# Altium project LimePSB-RPCM_1v3.PrjPcb (part 14 of 14)
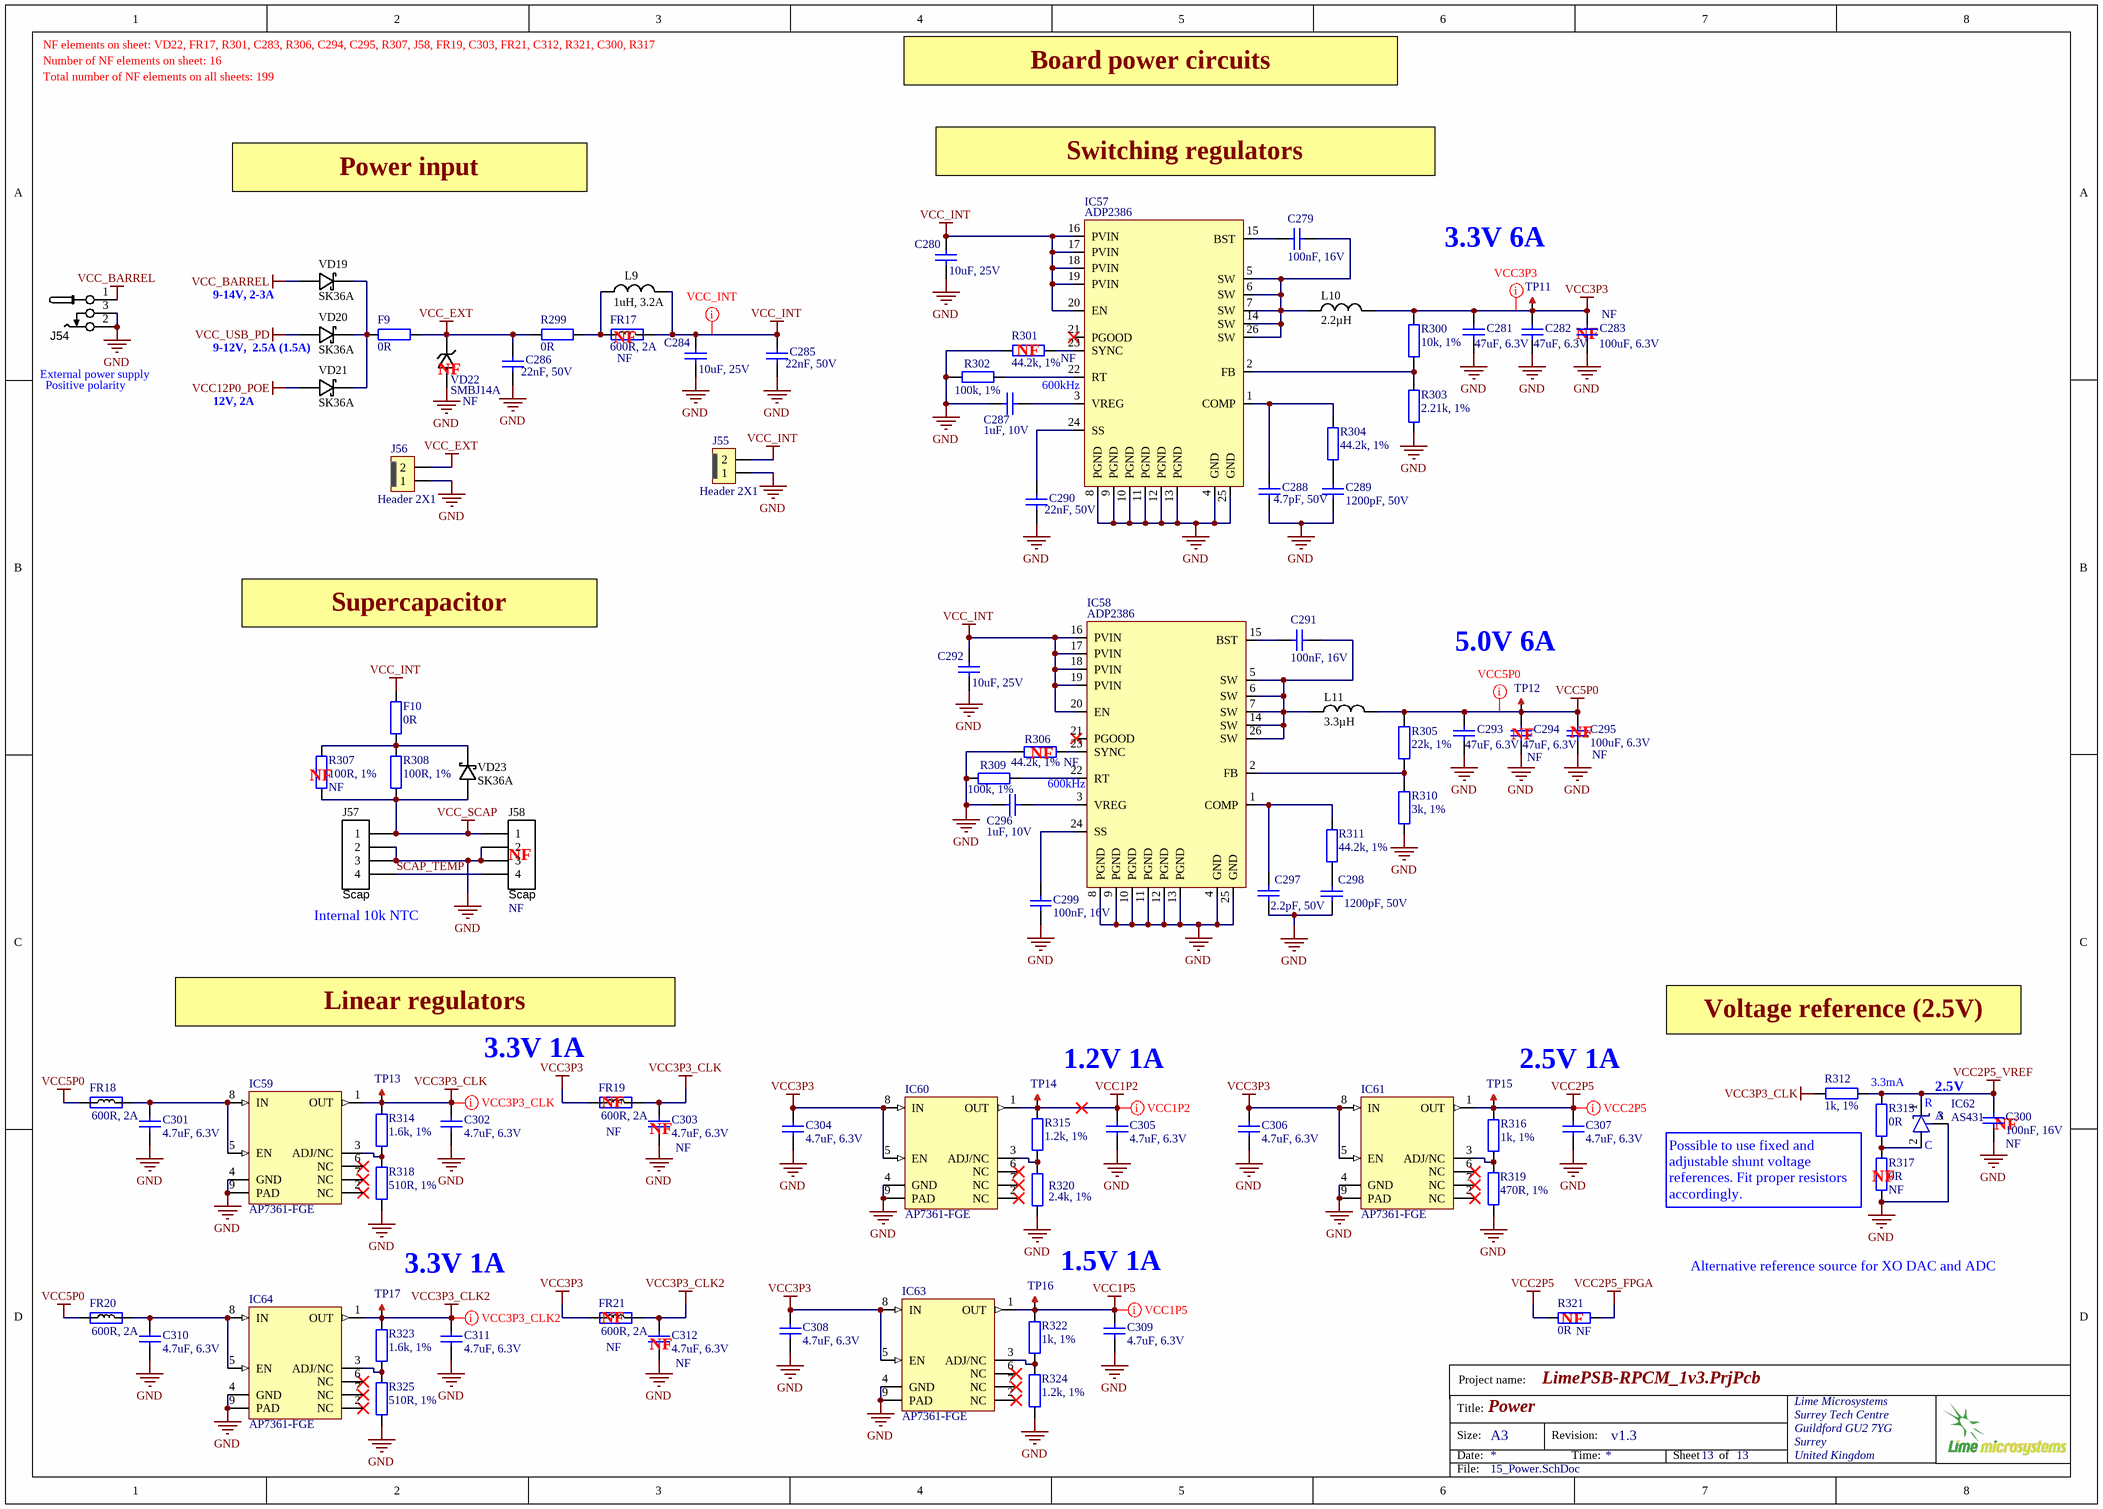
[diagram p15: 15_Power.SchDoc]

## Nets that join several sheets
GND: 05_RPi_mPCIe (82 pins), 06_Misc_1 (65 pins), 07_Misc_2 (72 pins), 08_FPGA (36 pins), 09_USB_hub (67 pins), 10_USB_HDMI (86 pins), 11_Clock_1 (76 pins), 12_Clock_2 (69 pins), 13_RFFE (142 pins), 14_PoE_USB_PD (31 pins), 15_Power (80 pins)
USB_VBUS_IN: 09_USB_hub (6 pins), 14_PoE_USB_PD (7 pins)
VCC1P2: 08_FPGA (7 pins), 15_Power (C305.2 IC60.1 R315.1 TP14.1)
VCC1P5: 05_RPi_mPCIe (J3.6 J3.28 J3.48), 15_Power (C309.2 IC63.1 R322.2 TP16.1)
VCC2P5_FPGA: 08_FPGA (C53.2 C54.1 D2.C IC17.24), 15_Power (R321.1)
VCC2P5_VREF: 07_Misc_2 (R47.1), 11_Clock_1 (R184.2), 15_Power (C300.2 IC62.1 R312.1 R313.1)
VCC3P0_BATT: 07_Misc_2 (BATT1.POSITIVE D1.A2 R80.2), 12_Clock_2 (J43.2 R230.2)
VCC3P3: 05_RPi_mPCIe (9 pins), 06_Misc_1 (26 pins), 07_Misc_2 (33 pins), 08_FPGA (19 pins), 09_USB_hub (28 pins), 10_USB_HDMI (9 pins), 12_Clock_2 (12 pins), 15_Power (17 pins)
VCC3P3_CLK: 11_Clock_1 (15 pins), 15_Power (7 pins)
VCC3P3_CLK2: 12_Clock_2 (FR9.1 FR10.1 FR11.1 FR12.1), 15_Power (6 pins)
VCC5P0: 05_RPi_mPCIe (8 pins), 06_Misc_1 (6 pins), 07_Misc_2 (6 pins), 09_USB_hub (8 pins), 10_USB_HDMI (11 pins), 13_RFFE (FR13.1 FR14.1), 15_Power (8 pins)
VCC12P0_POE: 07_Misc_2 (R55.1), 14_PoE_USB_PD (7 pins), 15_Power (VD21.A)
VCC_BARREL: 07_Misc_2 (R53.1), 15_Power (J54.1 VD19.A)
VCC_EXT: 07_Misc_2 (R56.1), 15_Power (5 pins)
VCC_INT: 07_Misc_2 (R57.1 R82.1), 15_Power (18 pins)
VCC_SCAP: 07_Misc_2 (R58.1), 15_Power (5 pins)
VCC_USB_PD: 07_Misc_2 (R54.1), 14_PoE_USB_PD (C272.2 IC55.5 IC55.6 IC56.11), 15_Power (VD20.A)
ADF_MUXOUT: 05_RPi_mPCIe (J1.56), 11_Clock_1 (IC34.15 R191.1)
BUZZER: 05_RPi_mPCIe (J1.34), 06_Misc_1 (R28.1 R31.1 VT1.G)
CAM1_CLK_N: 05_RPi_mPCIe (J2.27), 06_Misc_1 (J16.8)
CAM1_CLK_P: 05_RPi_mPCIe (J2.29), 06_Misc_1 (J16.9)
CAM1_D0_N: 05_RPi_mPCIe (J2.15), 06_Misc_1 (J16.2)
CAM1_D0_P: 05_RPi_mPCIe (J2.17), 06_Misc_1 (J16.3)
CAM1_D1_N: 05_RPi_mPCIe (J2.21), 06_Misc_1 (J16.5)
CAM1_D1_P: 05_RPi_mPCIe (J2.23), 06_Misc_1 (J16.6)
CAM1_GPIO0: 05_RPi_mPCIe (J1.97), 06_Misc_1 (J16.11)
DSI1_CLK_N: 05_RPi_mPCIe (J2.87), 06_Misc_1 (J15.5)
DSI1_CLK_P: 05_RPi_mPCIe (J2.89), 06_Misc_1 (J15.6)
DSI1_D0_N: 05_RPi_mPCIe (J2.75), 06_Misc_1 (J15.8)
DSI1_D0_P: 05_RPi_mPCIe (J2.77), 06_Misc_1 (J15.9)
DSI1_D1_N: 05_RPi_mPCIe (J2.81), 06_Misc_1 (J15.2)
DSI1_D1_P: 05_RPi_mPCIe (J2.83), 06_Misc_1 (J15.3)
EN_CM5_USB3: 05_RPi_mPCIe (IC1.6), 06_Misc_1 (SW1.4), 08_FPGA (IC17.4), 10_USB_HDMI (6 pins)
EN_RXA_LNA: 07_Misc_2 (IC13.26), 13_RFFE (IC53.3 R240.2 R250.1)
EN_RXB_LNA: 07_Misc_2 (IC13.28), 13_RFFE (IC51.3 R238.2 R248.1)
EN_TXA_PA: 07_Misc_2 (IC13.25), 13_RFFE (IC52.3 R239.2 R249.1)
EN_TXB_PA: 07_Misc_2 (IC13.27), 13_RFFE (IC50.3 R237.2 R247.1)
ETH_LED_G: 05_RPi_mPCIe (J1.17), 06_Misc_1 (R29.2)
ETH_LED_Y: 05_RPi_mPCIe (J1.15), 06_Misc_1 (R30.2)
ETH_TRD0_N: 05_RPi_mPCIe (J1.10), 06_Misc_1 (J9.2 VD2.A)
ETH_TRD0_P: 05_RPi_mPCIe (J1.12), 06_Misc_1 (J9.1 VD1.A)
ETH_TRD1_N: 05_RPi_mPCIe (J1.6), 06_Misc_1 (J9.6 VD4.A)
ETH_TRD1_P: 05_RPi_mPCIe (J1.4), 06_Misc_1 (J9.3 VD3.A)
ETH_TRD2_N: 05_RPi_mPCIe (J1.9), 06_Misc_1 (J9.8 VD6.A)
ETH_TRD2_P: 05_RPi_mPCIe (J1.11), 06_Misc_1 (J9.7 VD5.A)
ETH_TRD3_N: 05_RPi_mPCIe (J1.5), 06_Misc_1 (J9.10 VD8.A)
ETH_TRD3_P: 05_RPi_mPCIe (J1.3), 06_Misc_1 (J9.9 VD7.A)
ETH_VC1: 06_Misc_1 (J9.11 J13.2), 14_PoE_USB_PD (BR1.4)
ETH_VC2: 06_Misc_1 (J9.12 J13.1), 14_PoE_USB_PD (BR1.3)
ETH_VC3: 06_Misc_1 (J9.13 J13.4), 14_PoE_USB_PD (BR2.4)
ETH_VC4: 06_Misc_1 (J9.14 J13.3), 14_PoE_USB_PD (BR2.3)
FPGA_CRESET: 07_Misc_2 (IC13.2), 08_FPGA (C52.1 IC17.8 J25.2 R102.2)
FPGA_GPIO0: 06_Misc_1 (J10.12), 08_FPGA (IC17.45)
FPGA_GPIO1: 06_Misc_1 (J10.14), 08_FPGA (IC17.21)
FPGA_RF_SW_TDD: 07_Misc_2 (R39.2), 08_FPGA (IC17.13)
FPGA_SPI0_DAC_SS: 08_FPGA (IC17.42), 11_Clock_1 (R200.2)
FPGA_SPI0_MOSI: 08_FPGA (IC17.38), 11_Clock_1 (R202.2)
FPGA_SPI0_SCLK: 08_FPGA (IC17.43), 11_Clock_1 (R201.2)
FPGA_SYNC_OUT: 08_FPGA (IC17.3), 12_Clock_2 (J42.1)
GNSS _DDC_SCL: 08_FPGA (IC17.28), 12_Clock_2 (IC40.19)
GNSS _DDC_SDA: 08_FPGA (IC17.27), 12_Clock_2 (IC40.18)
GNSS_EXTINT: 08_FPGA (IC17.25), 12_Clock_2 (IC40.4)
GNSS_RESET: 08_FPGA (IC17.23), 12_Clock_2 (R225.1)
GNSS_TPULSE: 08_FPGA (IC17.20), 12_Clock_2 (IC40.3)
GNSS_UART_RX: 08_FPGA (IC17.32), 12_Clock_2 (IC40.21)
GNSS_UART_TX: 08_FPGA (IC17.31), 12_Clock_2 (IC40.20)
GNSS_USB_D_N: 09_USB_hub (R127.1), 12_Clock_2 (IC40.5)
GNSS_USB_D_P: 09_USB_hub (R125.1), 12_Clock_2 (IC40.6)
HDMI0_CEC: 05_RPi_mPCIe (J2.51), 10_USB_HDMI (ESD14.1 J31.13)
HDMI0_CLK_N: 05_RPi_mPCIe (J2.90), 10_USB_HDMI (ESD13.1 J31.12)
HDMI0_CLK_P: 05_RPi_mPCIe (J2.88), 10_USB_HDMI (ESD12.1 J31.10)
HDMI0_D0_N: 05_RPi_mPCIe (J2.84), 10_USB_HDMI (ESD11.1 J31.9)
HDMI0_D0_P: 05_RPi_mPCIe (J2.82), 10_USB_HDMI (ESD10.1 J31.7)
HDMI0_D1_N: 05_RPi_mPCIe (J2.78), 10_USB_HDMI (ESD9.1 J31.6)
HDMI0_D1_P: 05_RPi_mPCIe (J2.76), 10_USB_HDMI (ESD8.1 J31.4)
HDMI0_D2_N: 05_RPi_mPCIe (J2.72), 10_USB_HDMI (ESD7.1 J31.3)
HDMI0_D2_P: 05_RPi_mPCIe (J2.70), 10_USB_HDMI (ESD6.1 J31.1)
HDMI0_HPD: 05_RPi_mPCIe (J2.53), 10_USB_HDMI (ESD17.1 J31.19)
HDMI0_SCL: 05_RPi_mPCIe (J2.100), 10_USB_HDMI (ESD15.1 J31.15)
HDMI0_SDA: 05_RPi_mPCIe (J2.99), 10_USB_HDMI (ESD16.1 J31.16)
HDMI1_CEC: 05_RPi_mPCIe (J2.49), 10_USB_HDMI (ESD26.1 J32.13)
HDMI1_CLK_N: 05_RPi_mPCIe (J2.66), 10_USB_HDMI (ESD25.1 J32.12)
HDMI1_CLK_P: 05_RPi_mPCIe (J2.64), 10_USB_HDMI (ESD24.1 J32.10)
HDMI1_D0_N: 05_RPi_mPCIe (J2.60), 10_USB_HDMI (ESD23.1 J32.9)
HDMI1_D0_P: 05_RPi_mPCIe (J2.58), 10_USB_HDMI (ESD22.1 J32.7)
HDMI1_D1_N: 05_RPi_mPCIe (J2.54), 10_USB_HDMI (ESD21.1 J32.6)
HDMI1_D1_P: 05_RPi_mPCIe (J2.52), 10_USB_HDMI (ESD20.1 J32.4)
HDMI1_D2_N: 05_RPi_mPCIe (J2.48), 10_USB_HDMI (ESD19.1 J32.3)
HDMI1_D2_P: 05_RPi_mPCIe (J2.46), 10_USB_HDMI (ESD18.1 J32.1)
HDMI1_HPD: 05_RPi_mPCIe (J2.43), 10_USB_HDMI (ESD29.1 J32.19)
HDMI1_SCL: 05_RPi_mPCIe (J2.47), 10_USB_HDMI (ESD27.1 J32.15)
HDMI1_SDA: 05_RPi_mPCIe (J2.45), 10_USB_HDMI (ESD28.1 J32.16)
LMK10_CLK_OUT0: 08_FPGA (IC17.37), 12_Clock_2 (IC36.3)
LMKRF_CLK_OUT2: 11_Clock_1 (IC30.13), 12_Clock_2 (J41.1)
LMKRF_CLK_OUT3: 11_Clock_1 (IC30.15), 12_Clock_2 (J36.1)
LMKRF_CLK_OUT4: 08_FPGA (IC17.35), 11_Clock_1 (IC30.17)
PCIE_COEX1: 05_RPi_mPCIe (J3.3), 12_Clock_2 (R211.2)
PCIE_PPS_IN: 05_RPi_mPCIe (R2.2 R4.2), 12_Clock_2 (J39.2 R211.1)
PCIE_PPS_OUT: 05_RPi_mPCIe (R3.2 R8.2), 12_Clock_2 (J36.5 J40.1)
PCIE_UIM8: 05_RPi_mPCIe (J3.17), 08_FPGA (IC17.46)
PCIE_UIMC4: 05_RPi_mPCIe (J3.19), 12_Clock_2 (J41.2)
PCIE_USB_N: 05_RPi_mPCIe (J3.36), 09_USB_hub (R115.2 R119.1)
PCIE_USB_P: 05_RPi_mPCIe (J3.38), 09_USB_hub (R114.2 R116.1)
PTP_SYNC_SEL: 07_Misc_2 (IC13.3), 12_Clock_2 (IC39.10 R227.1)
REF_CLK_IN: 11_Clock_1 (C151.2 R178.2), 12_Clock_2 (J38.2)
RF_SW_TDD: 07_Misc_2 (J19.2 R39.1 R41.1), 13_RFFE (8 pins)
RPI_AIP0: 05_RPi_mPCIe (J1.96), 06_Misc_1 (J12.5)
RPI_AIP1: 05_RPi_mPCIe (J1.94), 06_Misc_1 (J12.6)
RPI_BTN1: 05_RPi_mPCIe (J1.45), 06_Misc_1 (BTN1.1 C21.1 R27.2)
RPI_BTN2: 05_RPi_mPCIe (J1.47), 06_Misc_1 (C10.1 J8.5 R15.2)
RPI_EEPROM_nWP: 05_RPi_mPCIe (J1.20), 06_Misc_1 (J12.4 R32.2)
RPI_GLOBAL_EN: 05_RPi_mPCIe (J1.99 J5.1), 06_Misc_1 (J12.14), 07_Misc_2 (R94.1)
RPI_GPIO2: 05_RPi_mPCIe (J1.58), 06_Misc_1 (J10.15)
RPI_GPIO4: 05_RPi_mPCIe (J1.54), 06_Misc_1 (J10.16)
RPI_GPIO22: 05_RPi_mPCIe (J1.46), 06_Misc_1 (J10.3)
RPI_GPIO27: 05_RPi_mPCIe (J1.48), 06_Misc_1 (J10.5)
RPI_I2C0_SCL: 05_RPi_mPCIe (J1.80 R12.2), 06_Misc_1 (J15.11 J16.13), 07_Misc_2 (10 pins), 08_FPGA (R99.1), 09_USB_hub (R143.2), 14_PoE_USB_PD (R297.2)
RPI_I2C0_SDA: 05_RPi_mPCIe (J1.82 R13.2), 06_Misc_1 (J15.12 J16.14), 07_Misc_2 (10 pins), 08_FPGA (R100.1), 09_USB_hub (R142.2), 14_PoE_USB_PD (R296.2)
RPI_ID_SC: 05_RPi_mPCIe (J1.35), 06_Misc_1 (J8.3 J10.18 R19.1)
RPI_ID_SD: 05_RPi_mPCIe (J1.36), 06_Misc_1 (J8.4 J10.17 R16.1)
RPI_LED_nPWR: 05_RPi_mPCIe (J1.95), 06_Misc_1 (IC2.2 R14.2 R17.2)
RPI_nEXTRST: 05_RPi_mPCIe (J1.100), 09_USB_hub (R121.2)
RPI_nRPIBOOT: 05_RPi_mPCIe (J1.93), 06_Misc_1 (J12.2 SW1.1)
RPI_PIN11: 05_RPi_mPCIe (IC1.4 J2.11 R9.2 R11.2), 06_Misc_1 (J12.11)
RPI_PIN16: 05_RPi_mPCIe (J1.16), 12_Clock_2 (IC39.2 R222.2)
RPI_PIN18: 05_RPi_mPCIe (J1.18), 12_Clock_2 (IC39.1 R221.2)
RPI_PWM0: 05_RPi_mPCIe (J1.31), 06_Misc_1 (IC5.3)
RPI_PWM1: 05_RPi_mPCIe (J1.28), 06_Misc_1 (IC5.1)
RPI_RUN_PG: 05_RPi_mPCIe (J1.92 J5.3), 06_Misc_1 (IC3.2 J12.10 R22.2)
RPI_SD_CLK: 05_RPi_mPCIe (J1.57), 06_Misc_1 (J7.5)
RPI_SD_CMD: 05_RPi_mPCIe (J1.62), 06_Misc_1 (J7.3)
RPI_SD_D0: 05_RPi_mPCIe (J1.63), 06_Misc_1 (J7.7)
RPI_SD_D1: 05_RPi_mPCIe (J1.67), 06_Misc_1 (J7.8)
RPI_SD_D2: 05_RPi_mPCIe (J1.69), 06_Misc_1 (J7.1)
RPI_SD_D3: 05_RPi_mPCIe (J1.61), 06_Misc_1 (J7.2)
RPI_SD_PWR_ON: 05_RPi_mPCIe (J1.75), 06_Misc_1 (IC4.3 R23.1)
RPI_SPI0_MISO: 05_RPi_mPCIe (J1.40), 06_Misc_1 (J10.11), 08_FPGA (R106.2 R107.1)
RPI_SPI0_MOSI: 05_RPi_mPCIe (J1.44), 06_Misc_1 (J10.9), 08_FPGA (R104.2 R105.1), 11_Clock_1 (R197.1)
RPI_SPI0_SCLK: 05_RPi_mPCIe (J1.38), 06_Misc_1 (J10.13), 08_FPGA (R103.1), 11_Clock_1 (R195.1)
RPI_SPI0_SS0: 05_RPi_mPCIe (J1.39), 08_FPGA (R108.2)
RPI_SPI0_SS1: 05_RPi_mPCIe (J1.37), 11_Clock_1 (R198.1)
RPI_SPI1_MISO: 05_RPi_mPCIe (J1.26), 07_Misc_2 (IC6.12), 08_FPGA (IC17.10)
RPI_SPI1_MOSI: 05_RPi_mPCIe (J1.27), 07_Misc_2 (IC6.11), 08_FPGA (IC17.9)
RPI_SPI1_SCLK: 05_RPi_mPCIe (J1.25), 07_Misc_2 (IC6.13), 08_FPGA (IC17.6)
RPI_SPI1_SS0: 05_RPi_mPCIe (J1.49), 07_Misc_2 (IC6.10)
RPI_SPI1_SS1: 05_RPi_mPCIe (J1.50), 08_FPGA (IC17.11)
RPI_SPI1_SS2: 05_RPi_mPCIe (J1.29), 08_FPGA (IC17.12)
RPI_STATUS_LED_G: 06_Misc_1 (IC2.4 R17.1), 07_Misc_2 (R89.1)
RPI_STATUS_LED_R: 05_RPi_mPCIe (J1.21), 07_Misc_2 (R91.1)
RPI_SYNC_IN: 06_Misc_1 (J12.8), 08_FPGA (IC17.2), 12_Clock_2 (IC41.4 J40.2 R229.1)
RPI_SYNC_OUT: 06_Misc_1 (J12.9), 08_FPGA (IC17.44), 12_Clock_2 (IC38.4 J42.3 R223.1)
RPI_TVDAC: 05_RPi_mPCIe (IC1.3 R11.1), 06_Misc_1 (J14.1 J17.4)
RPI_UART0_RX: 05_RPi_mPCIe (J1.51), 06_Misc_1 (J10.10 J11.3), 08_FPGA (IC17.34)
RPI_UART0_TX: 05_RPi_mPCIe (J1.55), 06_Misc_1 (J10.8 J11.2), 08_FPGA (IC17.36)
RPI_USB3_D0_N: 05_RPi_mPCIe (J2.36), 10_USB_HDMI (IC25.7)
RPI_USB3_D0_P: 05_RPi_mPCIe (J2.34), 10_USB_HDMI (IC25.6)
RPI_USB3_D1_N: 05_RPi_mPCIe (J2.65), 10_USB_HDMI (IC26.7)
RPI_USB3_D1_P: 05_RPi_mPCIe (J2.63), 10_USB_HDMI (IC26.6)
RPI_USB3_RX0_N: 05_RPi_mPCIe (J2.28), 10_USB_HDMI (IC28.4)
RPI_USB3_RX0_P: 05_RPi_mPCIe (J2.30), 10_USB_HDMI (IC28.5)
RPI_USB3_RX1_N: 05_RPi_mPCIe (J2.57), 10_USB_HDMI (IC29.4)
RPI_USB3_RX1_P: 05_RPi_mPCIe (J2.59), 10_USB_HDMI (IC29.5)
RPI_USB3_TX0_N: 05_RPi_mPCIe (J2.40), 10_USB_HDMI (IC28.1)
RPI_USB3_TX0_P: 05_RPi_mPCIe (J2.42), 10_USB_HDMI (IC28.2)
RPI_USB3_TX1_N: 05_RPi_mPCIe (J2.69), 10_USB_HDMI (IC29.1)
RPI_USB3_TX1_P: 05_RPi_mPCIe (J2.71), 10_USB_HDMI (IC29.2)
RPI_USB_D_N: 05_RPi_mPCIe (J2.3), 09_USB_hub (IC20.2 R141.2)
RPI_USB_D_P: 05_RPi_mPCIe (J2.5), 09_USB_hub (IC20.1 R140.2)
RPI_USB_OTG_ID: 05_RPi_mPCIe (J2.1), 09_USB_hub (R126.1 R134.2)
RPI_VBAT: 05_RPi_mPCIe (J1.76), 07_Misc_2 (R80.1)
RPI_VBUS_EN: 05_RPi_mPCIe (IC1.1 R9.1), 10_USB_HDMI (R156.2)
SCAP_TEMP: 07_Misc_2 (C32.1 IC6.7 R45.2 R49.1), 15_Power (J57.4 J58.4)
USB3H_1_D_N: 09_USB_hub (J28.5 VD12.A), 10_USB_HDMI (IC26.1)
USB3H_1_D_P: 09_USB_hub (J28.3 VD13.A), 10_USB_HDMI (IC26.2)
USB3H_1_RX_N: 09_USB_hub (ESD2.1 J28.17), 10_USB_HDMI (IC29.9)
USB3H_1_RX_P: 09_USB_hub (ESD3.1 J28.15), 10_USB_HDMI (IC29.8)
USB3H_1_TX_N: 09_USB_hub (ESD4.1 J28.11), 10_USB_HDMI (C104.2)
USB3H_1_TX_P: 09_USB_hub (ESD5.1 J28.9), 10_USB_HDMI (C106.2)
USB_C_RPI1: 06_Misc_1 (SW1.2), 09_USB_hub (J27.1 R133.1 R138.1)
USB_C_RPI2: 06_Misc_1 (SW1.7), 09_USB_hub (J27.2 R128.1 R129.1 R133.2)
USB_CC1: 09_USB_hub (J26.A5), 14_PoE_USB_PD (C278.1 IC56.15)
USB_CC2: 09_USB_hub (J26.B5), 14_PoE_USB_PD (C277.1 IC56.14)
USB_HUB_D2_N: 09_USB_hub (IC19.3), 10_USB_HDMI (IC25.5)
USB_HUB_D2_P: 09_USB_hub (IC19.4), 10_USB_HDMI (IC25.4)
USB_HUB_D3_N: 09_USB_hub (IC19.6), 10_USB_HDMI (IC26.5)
USB_HUB_D3_P: 09_USB_hub (IC19.7), 10_USB_HDMI (IC26.4)
USB_HUB_D4_N: 09_USB_hub (IC19.8), 10_USB_HDMI (J30.2 VD14.A)
USB_HUB_D4_P: 09_USB_hub (IC19.9), 10_USB_HDMI (J30.3 VD15.A)
USB_HUB_OCS_24: 09_USB_hub (IC19.21 IC19.27), 10_USB_HDMI (R158.2)
USB_HUB_PRTPWR_24: 09_USB_hub (IC19.20), 10_USB_HDMI (R154.2)
USB_PD_I: 06_Misc_1 (SW1.3), 14_PoE_USB_PD (J53.2 R287.1 R291.1)
XO10_VC: 11_Clock_1 (IC32.1), 12_Clock_2 (5 pins)
XO_VC_SEL: 07_Misc_2 (IC13.1), 11_Clock_1 (IC32.6)